# Altium project 02_SPACER_1.PrjPCB
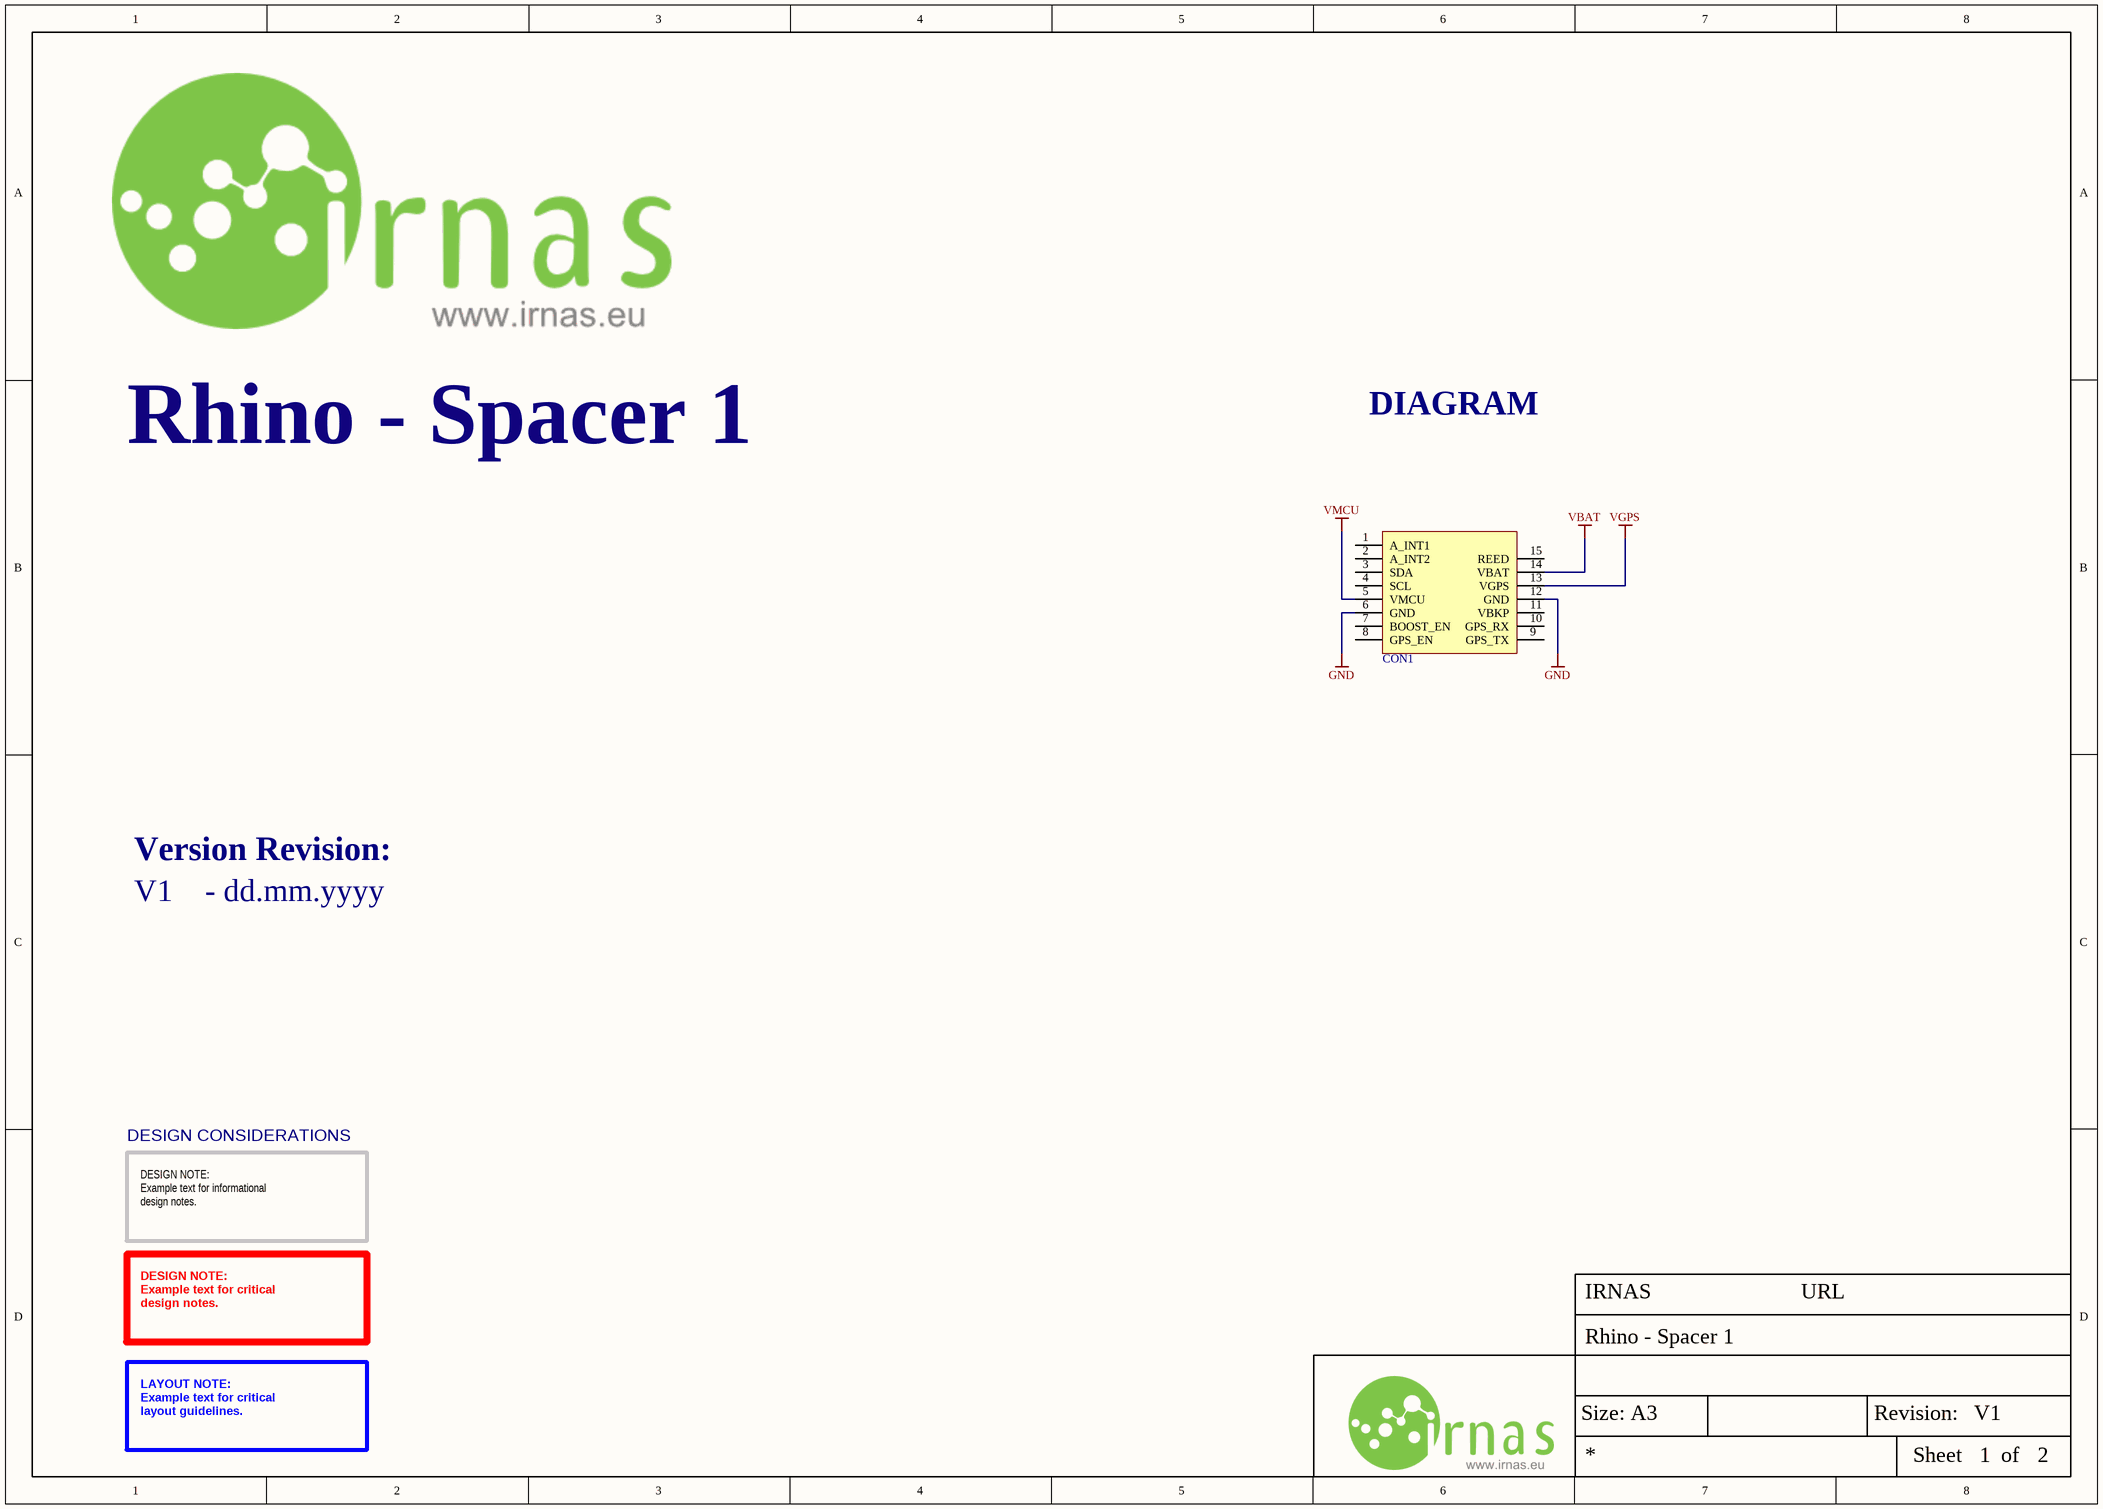
[diagram p0: MAIN_SPACER_1.SchDoc]
Company: IRNAS; CreateDate: 13.05.2019; PCBDesigner: Aleksej Cegner; ProjectTitle: Rhino - Spacer 1; RevisionDate: dd.mm.yyyy; Version: V1; Website: URL
1 sheet, 1 parts. Net scope: global (net labels, ports and power ports of the same name join across sheets).
Board file: SPACER_1.PcbDoc

## Sheet MAIN_SPACER_1.SchDoc
size A3; DocumentNumber: 1; SheetNumber: 1; SheetTotal: 2

### Parts
CON1  Between PCB connection  [SmartParks_Rhino]  (value not drawn)

### Nets
GND: CON1.6(GND) CON1.12(GND)
VBAT: CON1.14(VBAT)
VGPS: CON1.13(VGPS)
VMCU: CON1.5(VMCU)

Not connected (* = marked no-connect by the designer): CON1 1(A_INT1) 2(A_INT2) 3(SDA) 4(SCL) 7(BOOST_EN) 8(GPS_EN) 9(GPS_TX) 10(GPS_RX) 11(VBKP) 15(REED)

### Notes on the sheet
- DIAGRAM
- Version Revision:
- V1    - dd.mm.yyyy
- DESIGN CONSIDERATIONS
- DESIGN NOTE:
  Example text for informational
  design notes.
- DESIGN NOTE:
  Example text for critical
  design notes.
- LAYOUT NOTE:
  Example text for critical
  layout guidelines.
- Size: A3
- Revision:
- Sheet
- of

### Library data of the parts
CON1 = SmartParks_Rhino

## Assembly variants
BASIC: all parts fitted